# Altium schematic sheet Printing4.SchDoc
size A3
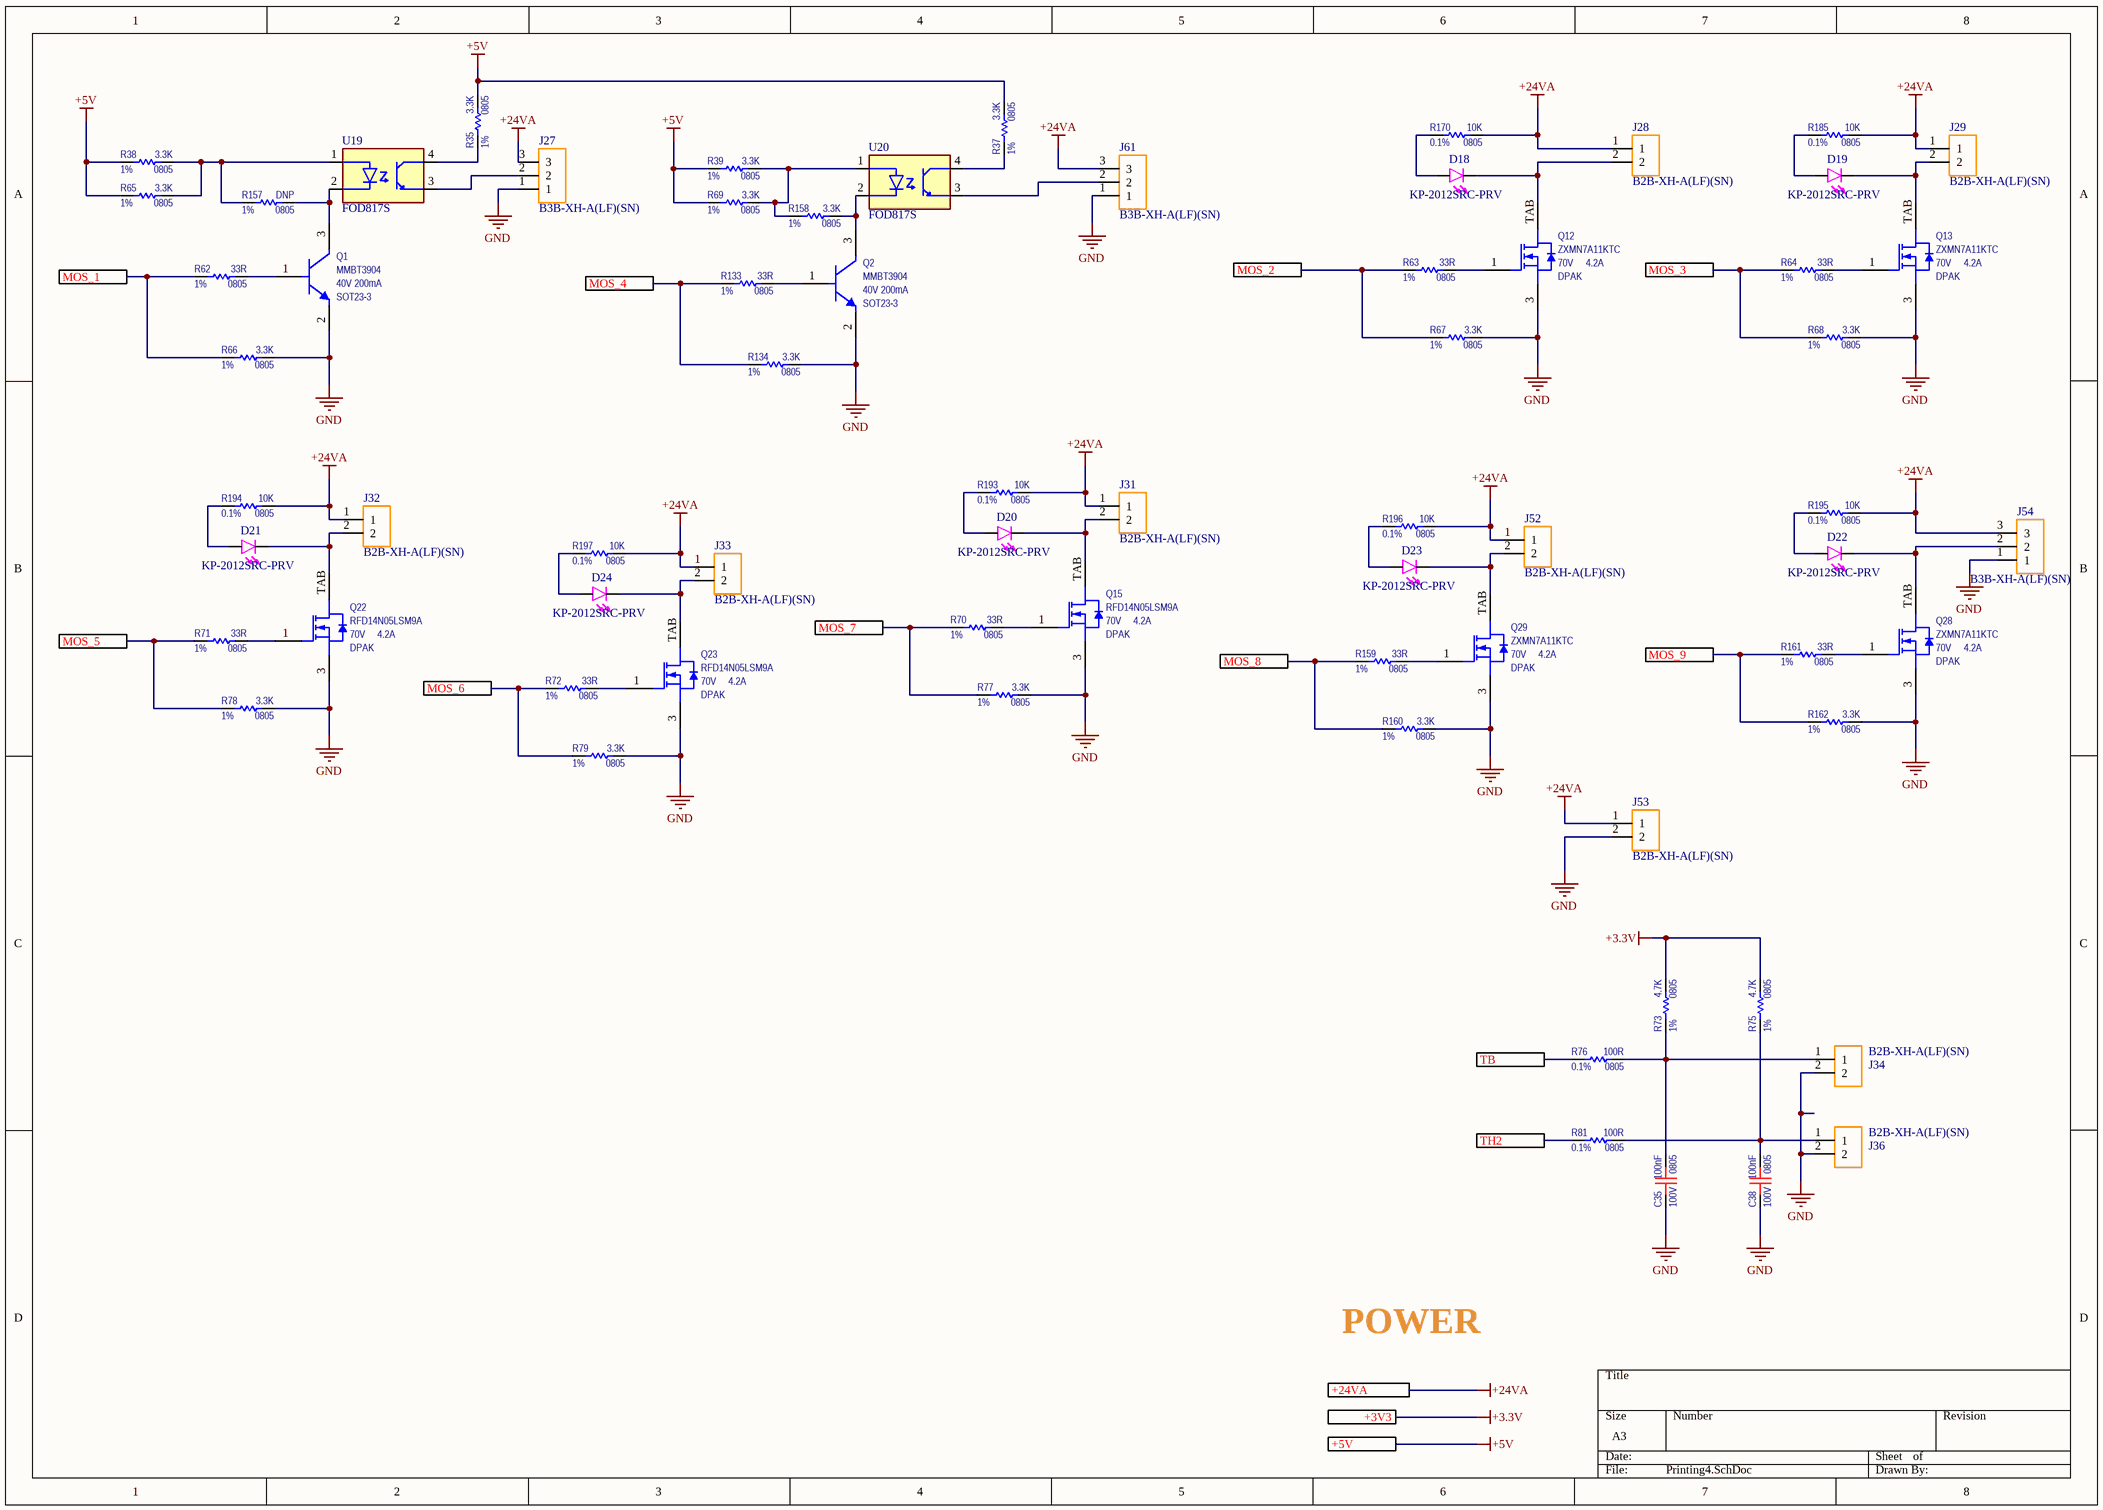
[diagram p0: Printing4.SchDoc]

## Parts
C35  value 100nF  Voltage: 100V  Package: 0805  [C_0805_GEN_1.40H]  (hidden comment: ESDSafeCapacitor)
C38  value 100nF  Voltage: 100V  Package: 0805  [C_0805_GEN_1.40H]  (hidden comment: ESDSafeCapacitor)
D18  KP-2012SRC-PRV  [0805 LED]
D19  KP-2012SRC-PRV  [0805 LED]
D20  KP-2012SRC-PRV  [0805 LED]
D21  KP-2012SRC-PRV  [0805 LED]
D22  KP-2012SRC-PRV  [0805 LED]
D23  KP-2012SRC-PRV  [0805 LED]
D24  KP-2012SRC-PRV  [0805 LED]
J27  B3B-XH-A(LF)(SN)  [JST_B3B-XH-A(LF)(SN)]
J28  B2B-XH-A(LF)(SN)  [JST_B2B-XH-A(LF)(SN)]
J29  B2B-XH-A(LF)(SN)  [JST_B2B-XH-A(LF)(SN)]
J31  B2B-XH-A(LF)(SN)  [JST_B2B-XH-A(LF)(SN)]
J32  B2B-XH-A(LF)(SN)  [JST_B2B-XH-A(LF)(SN)]
J33  B2B-XH-A(LF)(SN)  [JST_B2B-XH-A(LF)(SN)]
J34  B2B-XH-A(LF)(SN)  [JST_B2B-XH-A(LF)(SN)]
J36  B2B-XH-A(LF)(SN)  [JST_B2B-XH-A(LF)(SN)]
J52  B2B-XH-A(LF)(SN)  [JST_B2B-XH-A(LF)(SN)]
J53  B2B-XH-A(LF)(SN)  [JST_B2B-XH-A(LF)(SN)]
J54  B3B-XH-A(LF)(SN)  [JST_B3B-XH-A(LF)(SN)]
J61  B3B-XH-A(LF)(SN)  [JST_B3B-XH-A(LF)(SN)]
Q1  value MMBT3904  Current: 200mA  Voltage: 40V  Package: SOT23-3  [SOT23-3_MMBT3904,215]  (hidden comment: SingleNPN_B1E2C3)
Q2  value MMBT3904  Current: 200mA  Voltage: 40V  Package: SOT23-3  [SOT23-3_MMBT3904,215]  (hidden comment: SingleNPN_B1E2C3)
Q12  value ZXMN7A11KTC  Current: 4.2A  Voltage: 70V  Package: DPAK  [DPAK_SQD50N10-8M9L]  (hidden comment: SingleNMOS_G1S3DTAB)
Q13  value ZXMN7A11KTC  Current: 4.2A  Voltage: 70V  Package: DPAK  [DPAK_SQD50N10-8M9L]  (hidden comment: SingleNMOS_G1S3DTAB)
Q15  value RFD14N05LSM9A  Current: 4.2A  Voltage: 70V  Package: DPAK  [DPAK_SQD50N10-8M9L]  (hidden comment: SingleNMOS_G1S3DTAB)
Q22  value RFD14N05LSM9A  Current: 4.2A  Voltage: 70V  Package: DPAK  [DPAK_SQD50N10-8M9L]  (hidden comment: SingleNMOS_G1S3DTAB)
Q23  value RFD14N05LSM9A  Current: 4.2A  Voltage: 70V  Package: DPAK  [DPAK_SQD50N10-8M9L]  (hidden comment: SingleNMOS_G1S3DTAB)
Q28  value ZXMN7A11KTC  Current: 4.2A  Voltage: 70V  Package: DPAK  [DPAK_SQD50N10-8M9L]  (hidden comment: SingleNMOS_G1S3DTAB)
Q29  value ZXMN7A11KTC  Current: 4.2A  Voltage: 70V  Package: DPAK  [DPAK_SQD50N10-8M9L]  (hidden comment: SingleNMOS_G1S3DTAB)
R35  value 3.3K  Tolerance: 1%  Package: 0805  [R_0805_GEN_0.70H]  (hidden comment: StandardResistor)
R37  value 3.3K  Tolerance: 1%  Package: 0805  [R_0805_GEN_0.70H]  (hidden comment: StandardResistor)
R38  value 3.3K  Tolerance: 1%  Package: 0805  [R_0805_GEN_0.70H]  (hidden comment: StandardResistor)
R39  value 3.3K  Tolerance: 1%  Package: 0805  [R_0805_GEN_0.70H]  (hidden comment: StandardResistor)
R62  value 33R  Tolerance: 1%  Package: 0805  [R_0805_GEN_0.70H]  (hidden comment: StandardResistor)
R63  value 33R  Tolerance: 1%  Package: 0805  [R_0805_GEN_0.70H]  (hidden comment: StandardResistor)
R64  value 33R  Tolerance: 1%  Package: 0805  [R_0805_GEN_0.70H]  (hidden comment: StandardResistor)
R65  value 3.3K  Tolerance: 1%  Package: 0805  [R_0805_GEN_0.70H]  (hidden comment: StandardResistor)
R66  value 3.3K  Tolerance: 1%  Package: 0805  [R_0805_GEN_0.70H]  (hidden comment: StandardResistor)
R67  value 3.3K  Tolerance: 1%  Package: 0805  [R_0805_GEN_0.70H]  (hidden comment: StandardResistor)
R68  value 3.3K  Tolerance: 1%  Package: 0805  [R_0805_GEN_0.70H]  (hidden comment: StandardResistor)
R69  value 3.3K  Tolerance: 1%  Package: 0805  [R_0805_GEN_0.70H]  (hidden comment: StandardResistor)
R70  value 33R  Tolerance: 1%  Package: 0805  [R_0805_GEN_0.70H]  (hidden comment: StandardResistor)
R71  value 33R  Tolerance: 1%  Package: 0805  [R_0805_GEN_0.70H]  (hidden comment: StandardResistor)
R72  value 33R  Tolerance: 1%  Package: 0805  [R_0805_GEN_0.70H]  (hidden comment: StandardResistor)
R73  value 4.7K  Tolerance: 1%  Package: 0805  [R_0805_GEN_0.60H]  (hidden comment: StandardResistor)
R75  value 4.7K  Tolerance: 1%  Package: 0805  [R_0805_GEN_0.60H]  (hidden comment: StandardResistor)
R76  value 100R  Tolerance: 0.1%  Package: 0805  [R_0805_GEN_0.70H]  (hidden comment: StandardResistor)
R77  value 3.3K  Tolerance: 1%  Package: 0805  [R_0805_GEN_0.70H]  (hidden comment: StandardResistor)
R78  value 3.3K  Tolerance: 1%  Package: 0805  [R_0805_GEN_0.70H]  (hidden comment: StandardResistor)
R79  value 3.3K  Tolerance: 1%  Package: 0805  [R_0805_GEN_0.70H]  (hidden comment: StandardResistor)
R81  value 100R  Tolerance: 0.1%  Package: 0805  [R_0805_GEN_0.70H]  (hidden comment: StandardResistor)
R133  value 33R  Tolerance: 1%  Package: 0805  [R_0805_GEN_0.70H]  (hidden comment: StandardResistor)
R134  value 3.3K  Tolerance: 1%  Package: 0805  [R_0805_GEN_0.70H]  (hidden comment: StandardResistor)
R157  value DNP  Tolerance: 1%  Package: 0805  [R_0805_GEN_0.70H]  (hidden comment: StandardResistor)
R158  value 3.3K  Tolerance: 1%  Package: 0805  [R_0805_GEN_0.70H]  (hidden comment: StandardResistor)
R159  value 33R  Tolerance: 1%  Package: 0805  [R_0805_GEN_0.70H]  (hidden comment: StandardResistor)
R160  value 3.3K  Tolerance: 1%  Package: 0805  [R_0805_GEN_0.70H]  (hidden comment: StandardResistor)
R161  value 33R  Tolerance: 1%  Package: 0805  [R_0805_GEN_0.70H]  (hidden comment: StandardResistor)
R162  value 3.3K  Tolerance: 1%  Package: 0805  [R_0805_GEN_0.70H]  (hidden comment: StandardResistor)
R170  value 10K  Tolerance: 0.1%  Package: 0805  [R_0805_GEN_0.70H]  (hidden comment: StandardResistor)
R185  value 10K  Tolerance: 0.1%  Package: 0805  [R_0805_GEN_0.70H]  (hidden comment: StandardResistor)
R193  value 10K  Tolerance: 0.1%  Package: 0805  [R_0805_GEN_0.70H]  (hidden comment: StandardResistor)
R194  value 10K  Tolerance: 0.1%  Package: 0805  [R_0805_GEN_0.70H]  (hidden comment: StandardResistor)
R195  value 10K  Tolerance: 0.1%  Package: 0805  [R_0805_GEN_0.70H]  (hidden comment: StandardResistor)
R196  value 10K  Tolerance: 0.1%  Package: 0805  [R_0805_GEN_0.70H]  (hidden comment: StandardResistor)
R197  value 10K  Tolerance: 0.1%  Package: 0805  [R_0805_GEN_0.70H]  (hidden comment: StandardResistor)
U19  FOD817S  [SOIC254P1016X385-4N]
U20  FOD817S  [SOIC254P1016X385-4N]

## Ports
+3V3, +5V, +24VA, MOS_1, MOS_2, MOS_3, MOS_4, MOS_5, MOS_6, MOS_7, MOS_8, MOS_9, TB, TH2

## Nets
+3.3V: R73.2 R75.2 ; port +3V3
+5V: R35.2 R37.2 R38.1 R39.1 R65.1 R69.1 ; port +5V
+24VA: J27.3 J28.1 J29.1 J31.1 J32.1 J33.1 J52.1 J53.1 J54.3 J61.3 R170.2 R185.2 R193.2 R194.2 R195.2 R196.2 R197.2 ; port +24VA
GND: C35.1 C38.1 J27.1 J34.2 J36.2 J53.2 J54.1 J61.1 Q1.2(EMITTER) Q2.2(EMITTER) Q12.3(SOURCE) Q13.3(SOURCE) Q15.3(SOURCE) Q22.3(SOURCE) Q23.3(SOURCE) Q28.3(SOURCE) Q29.3(SOURCE) R66.2 R67.2 R68.2 R77.2 R78.2 R79.2 R134.2 R160.2 R162.2
MOS_1: R62.1 R66.1 ; port MOS_1
MOS_2: R63.1 R67.1 ; port MOS_2
MOS_3: R64.1 R68.1 ; port MOS_3
MOS_4: R133.1 R134.1 ; port MOS_4
MOS_5: R71.1 R78.1 ; port MOS_5
MOS_6: R72.1 R79.1 ; port MOS_6
MOS_7: R70.1 R77.1 ; port MOS_7
MOS_8: R159.1 R160.1 ; port MOS_8
MOS_9: R161.1 R162.1 ; port MOS_9
TB: R76.1 ; port TB
TH2: R81.1 ; port TH2
NetC35_2: C35.2 J34.1 R73.1 R76.2
NetC38_2: C38.2 J36.1 R75.1 R81.2
NetD18_A: D18.A R170.1
NetD18_K: D18.K(C) J28.2 Q12.TAB(DRAIN)
NetD19_A: D19.A R185.1
NetD19_K: D19.K(C) J29.2 Q13.TAB(DRAIN)
NetD20_A: D20.A R193.1
NetD20_K: D20.K(C) J31.2 Q15.TAB(DRAIN)
NetD21_A: D21.A R194.1
NetD21_K: D21.K(C) J32.2 Q22.TAB(DRAIN)
NetD22_A: D22.A R195.1
NetD22_K: D22.K(C) J54.2 Q28.TAB(DRAIN)
NetD23_A: D23.A R196.1
NetD23_K: D23.K(C) J52.2 Q29.TAB(DRAIN)
NetD24_A: D24.A R197.1
NetD24_K: D24.K(C) J33.2 Q23.TAB(DRAIN)
NetJ27_2: J27.2 U19.3(EMITTER)
NetJ61_2: J61.2 U20.3(EMITTER)
NetQ1_1: Q1.1(BASE) R62.2
NetQ1_3: Q1.3(COLLECTOR) R157.2 U19.2(CATHODE)
NetQ2_1: Q2.1(BASE) R133.2
NetQ2_3: Q2.3(COLLECTOR) R158.2 U20.2(CATHODE)
NetQ12_1: Q12.1(GATE) R63.2
NetQ13_1: Q13.1(GATE) R64.2
NetQ15_1: Q15.1(GATE) R70.2
NetQ22_1: Q22.1(GATE) R71.2
NetQ23_1: Q23.1(GATE) R72.2
NetQ28_1: Q28.1(GATE) R161.2
NetQ29_1: Q29.1(GATE) R159.2
NetR35_1: R35.1 U19.4(COLLECTOR)
NetR37_1: R37.1 U20.4(COLLECTOR)
NetR38_2: R38.2 R65.2 R157.1 U19.1(ANODE)
NetR39_2: R39.2 R69.2 R158.1 U20.1(ANODE)

## Notes on the sheet
- POWER

## Library data of the parts
C35 C38 = CER_100nF_#4: CAP_CER_100nF_100V_X7R_10%_0805; Manufacturer#1: Kemet; Manufacturer#1 PN: C0805C104K1RECAUTO; Manufacturer#2 PN: ESD51C104K4T2A-24; Similar Part: C0805C104J1RECAUTO7210; C0805X104J1RECAUTO; Added by: İlhanT; FireANTs Code: C00062; Grade Level: Automotive; Lead Status: Pb-Free; Location: 3B16; Max Reflow Duration: 30; Max Reflow Temp: 260; Placement Area: 10.45; Power Rating: X; Temp# Operating: -55°C/+125°C; Tolerance: 10%; Identifier: CER_100nF_#4; Checked by: İlkerU; ComponentLink1Description: Resource Folder; ComponentLink1URL: C:\FireANTs_Repo\HW_Lib\trunk\ComponentLibrary\Resources\Capacitors\C00062; Cost: 0.27; Current: N/A; Failure in Time: N/A; Features: AEC-Q200; ESD withstanding; Height: 1.40; Manufacturer#2: AVX; MSL: 1; Mounting Type: SMD; Part Status: Active; Temp# Storage: N/A; Weight: 19mg
D18-D24 = KP-2012SRC-PRV: KP-2012SRC-PRV Red LED, 640 nm 2012 (0805), Rectangle Lens SMD package; Manufacturer: Kingbright; Lens Color: Clear; Viewing Angle: 120°; Lens Style: Rectangular,Diffused,Colorless; Number of LEDs: 1; Wavelength: 640nm; Luminous Intensity: 100mcd; Forward Voltage: 1.85V; Forward Current: 20mA; Supplier 1: Farnell; Manufacturer Part Number: KP-2012SRC-PRV; RoHS: Yes; Category: LEDs; Pricing 1: 5=0,12900, 50=0,10200, 100=0,09830, 500=0,08370, 1000=0,07290 (EUR); Mount: Surface Mount; Case/Package: 2012; Number of Pins: 2; Color: Red; Min Operating Temperature: -40°C; Max Operating Temperature: 85°C; Packaging: Cut Tape; Dominant Wavelength: 640nm; Radiation Hardening: No; Reach SVHC Compliant: Yes; RoHS Compliant: Yes; ComponentLink1URL: https://datasheet.ciiva.com/14176/kp2012src-prv-eng-tds-14176962.pdf?src-supplier=Distrelec; ComponentLink1Description: https://datasheet.ciiva.com/14176/kp2012src-prv-eng-tds-14176962.pdf?src-supplier=Distrelec; ComponentLink2URL: https://datasheet.ciiva.com/11773/0900766b8032fa8d-11773524.pdf?src-supplier=RSComponents; ComponentLink2Description: https://datasheet.ciiva.com/11773/0900766b8032fa8d-11773524.pdf?src-supplier=RSComponents; ComponentLink3URL: https://datasheet.ciiva.com/14634/0900766b8032fa8d-14634746.pdf?src-supplier=Allied+Electronics; ComponentLink3Description: https://datasheet.ciiva.com/14634/0900766b8032fa8d-14634746.pdf?src-supplier=Allied+Electronics; ComponentLink4URL: https://datasheet.ciiva.com/29281/180105-da-01-en-led-0805-typ-kp-2012src-prv-29281248.pdf?src-supplier=Conrad; ComponentLink4Description: https://datasheet.ciiva.com/29281/180105-da-01-en-led-0805-typ-kp-2012src-prv-29281248.pdf?src-supplier=Conrad; Supplier Part Number 1: 1318244
J28 J29 J31-J34 J36 J52 J53 = B2B-XH-A(LF)(SN): Connector Header Through Hole 2 position 0.098 (2.50mm); MF: JST Sales; MP: B2B-XH-A(LF)(SN); Package: None; SnapEDA_Link: https://www.snapeda.com/parts/B2B-XH-A(LF)(SN)/JST+Sales+America+Inc./view-part/?ref=snap; Purchase-URL: https://pricing.snapeda.com/search/part/B2B-XH-A(LF)(SN)/?ref=eda; Check_prices: https://www.snapeda.com/parts/B2B-XH-A(LF)(SN)/JST+Sales+America+Inc./view-part/?ref=eda; Availability: In Stock; Value: *; Price: None
Q1 Q2 = NPN_40V-200mA_#1: TRA_NPN_SING_40V_200mA_VSAT300mV_SOT23-3; Manufacturer#1: Nexperia; Manufacturer#1 PN: MMBT3904,215; Manufacturer#2 PN: MMBT3904-7-F; Similar Part: SST3904HZGT116; PMBT3904,235; Added by: HasanA; FireANTs Code: Q00012; Failure in Time: 0.44@[60%CL; 55°C; 0.7eV]; Grade Level: Industrial; Lead Status: Pb-Free; Location: 4D3; Max Reflow Duration: 30; Max Reflow Temp: 260; Placement Area: 14.00; Power Rating: X; Temp# Operating: -65°C/+150°C; Identifier: NPN_40V-200mA_#1; Checked by: EserC; ComponentLink1Description: Resource Folder; ComponentLink1URL: C:\BNA_Repo\HW_Lib\trunk\ComponentLibrary\Resources\Transistors\Q00012; Cost: 0.10; Features: Single NPN signal BJT; Height: 1.10; Manufacturer#2: Diodes; MSL: 1; Mounting Type: SMD; Part Status: Active; Temp# Storage: -65°C/+150°C; Tolerance: X; Weight: 7.48mg
Q12 Q13 Q15 Q22 Q23 Q28 Q29 = NMOS_100V-50A_#1: TRA_NMOS_SING_100V_50A_TH2V_DPAK; Manufacturer#1: Vishay; Manufacturer#1 PN: SQD50N10-8M9L; Similar Part: SQM70060EL_GE3; SQM100N10-10_GE3; Added by: İlhanT; FireANTs Code: Q00028; Failure in Time: 1.84@[60%CL; 55°C; 0.7eV]; Grade Level: Automotive; Lead Status: Pb-Free; Location: 4D7; Max Reflow Duration: 10; Max Reflow Temp: 260; Placement Area: 97.50; Power Rating: X; Temp# Operating: -55°C/+175°C; Identifier: NMOS_100V-50A_#1; Checked by: YasinY; ComponentLink1Description: Resource Folder; ComponentLink1URL: C:\BNA_Repo\HW_Lib\trunk\ComponentLibrary\Resources\Transistors\Q00028; Cost: 1.54; Features: AEC-Q101;  Single nMOS; Rdson=11.2mR@Vgs=4.5V@25°C; Qgate(tot)=70nC; Vgsmax=±20V; Height: 2.38; Manufacturer#2: N/A; Manufacturer#2 PN: N/A; MSL: 1; Mounting Type: SMD; Part Status: Active; Temp# Storage: -55°C/+175°C; Tolerance: X; Weight: 370mg
R35 R37-R39 R65-R69 R77-R79 R134 R157 R158 R160 R162 = STD_3.3K_#3: RES_STD_3.3K_0.125W_1%_100ppm_0805; Manufacturer#1: Yageo; Manufacturer#1 PN: AC0805FR-073K3L; Manufacturer#2 PN: ERJ-6ENF3301V; Added by: HasanA; FireANTs Code: R00131; Current: X; Grade Level: Automotive; Lead Status: Pb-Free; Location: 2G8; Max Reflow Duration: 10; Max Reflow Temp: 260; Placement Area: 10.45; Power Rating: 125mW; Temp# Operating: -55°C/+155°C; Voltage: 150V; Identifier: STD_3.3K_#3; Checked by: YasinY; ComponentLink1Description: Resource Folder; ComponentLink1URL: C:\FireANTs_Repo\HW_Lib\trunk\ComponentLibrary\Resources\Resistors\R00131; Cost: 0.10; Failure in Time: N/A; Features: AEC-Q200; Height: 0.70; Manufacturer#2: Panasonic; MSL: 1; Mounting Type: SMD; Part Status: Active; Similar Part: N/A; Temp# Storage: N/A; Weight: 5.5mg
R62-R64 R70-R72 R133 R159 R161 = STD_33R_#3: RES_STD_33R_0.125W_1%_100ppm_0805; Manufacturer#1: Yageo; Manufacturer#1 PN: AC0805FR-0733RL; Manufacturer#2 PN: ERJ-6ENF33R0V; Added by: HasanA; FireANTs Code: R00051; Current: X; Grade Level: Automotive; Lead Status: Pb-Free; Location: 2C13; Max Reflow Duration: 10; Max Reflow Temp: 260; Placement Area: 10.45; Power Rating: 125mW; Temp# Operating: -55°C/+155°C; Voltage: 150V; Identifier: STD_33R_#3; Checked by: YasinY; ComponentLink1Description: Resource Folder; ComponentLink1URL: C:\FireANTs_Repo\HW_Lib\trunk\ComponentLibrary\Resources\Resistors\R00051; Cost: 0.10; Failure in Time: N/A; Features: AEC-Q200; Height: 0.70; Manufacturer#2: Panasonic; MSL: 1; Mounting Type: SMD; Part Status: Active; Similar Part: N/A; Temp# Storage: N/A; Weight: 5.5mg
R73 R75 = STD_4.7K_#3: RES_STD_4.7K_0.125W_1%_100ppm_0805; Manufacturer#1: Yageo; Manufacturer#1 PN: AC0805FR-074K7L; Manufacturer#2 PN: ERJ-6ENF4701V; Added by: SonerI; FireANTs Code: R00230; Current: X; Grade Level: Automotive; Lead Status: Pb-Free; Location: TBD; Max Reflow Duration: 10; Max Reflow Temp: 260; Placement Area: 10.45; Power Rating: 125mW; Temp# Operating: -55°C/+155°C; Voltage: 150V; Identifier: STD_4.7K_#3; Checked by: YasinY; ComponentLink1Description: Resource Folder; ComponentLink1URL: C:\FireANTs_Repo\HW_Lib\trunk\ComponentLibrary\Resources\Resistors\R00230; Cost: 0.10; Failure in Time: N/A; Features: AEC-Q200; Height: 0.60; Manufacturer#2: Panasonic; MSL: 1; Mounting Type: SMD; Part Status: Active; Similar Part: N/A; Temp# Storage: N/A; Weight: 5.5mg
R76 R81 = STD_100R_#5: RES_STD_100R_0.125W_0.1%_10ppm_0805; Manufacturer#1: Yageo; Manufacturer#1 PN: RT0805BRB07100RL; Manufacturer#2 PN: RQ73C2A100RBTD; Similar Part: RNCF0805TKY100R; RG2012N-101-W-T1; Added by: HasanA; FireANTs Code: R00072; Current: X; Grade Level: Industrial; Lead Status: Pb-Free; Location: 2D18; Max Reflow Duration: 10; Max Reflow Temp: 260; Placement Area: 10.45; Power Rating: 125mW; Temp# Operating: -55°C/+155°C; Voltage: 150V; Identifier: STD_100R_#5; Checked by: YasinY; ComponentLink1Description: Resource Folder; ComponentLink1URL: C:\FireANTs_Repo\HW_Lib\trunk\ComponentLibrary\Resources\Resistors\R00072; Cost: 0.73; Failure in Time: N/A; Features: N/A; Height: 0.70; Manufacturer#2: TE Connectivity; MSL: 1; Mounting Type: SMD; Part Status: Active; Temp# Storage: N/A; Weight: 5.5mg
R170 R185 R193-R197 = STD_2K_#7: RES_STD_2K_0.125W_0.1%_25ppm_0805; Manufacturer#1: Panasonic; Manufacturer#1 PN: ERA-6AEB202V; Manufacturer#2 PN: RG2012P-202-B-T5; Similar Part: ERA-6ARB202V; Added by: İlhanT; FireANTs Code: R00087; Current: X; Grade Level: Automotive; Lead Status: Pb-Free; Location: 2C22; Max Reflow Duration: 10; Max Reflow Temp: 260; Placement Area: 10.45; Power Rating: 125mW; Temp# Operating: -55°C/+155°C; Voltage: 100V; Identifier: STD_2K_#7; Checked by: YasinY; ComponentLink1Description: Resource Folder; ComponentLink1URL: C:\FireANTs_Repo\HW_Lib\trunk\ComponentLibrary\Resources\Resistors\R00087; Cost: 0.31; Failure in Time: N/A; Features: AEC-Q200; Height: 0.70; Manufacturer#2: Susumu; MSL: 1; Mounting Type: SMD; Part Status: Active; Temp# Storage: N/A; Weight: 5.5mg
U19 U20 = FOD817S: Optoisolator Transistor Output 5000Vrms 1 Channel 4-SMD; MF: ON Semiconductor; Price: None; Availability: Unavailable; Package: SMD-4 ON Semiconductor; SnapEDA_Link: https://www.snapeda.com/parts/FOD817S/ON%20Semiconductor/view-part/2890432/?ref=snap; MP: FOD817S; Value: *
J27 J54 J61 = B3B-XH-A(LF)(SN): Value: *; MP: B3B-XH-A(LF)(SN); Availability: Unavailable; Package: None; Price: None